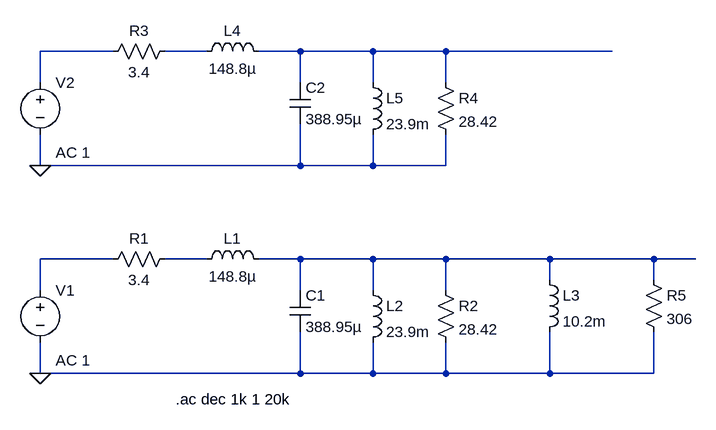
[diagram p0: schematic basic_pyle.asc]
basic_pyle.asc, the LTspice schematic file:
Version 4
SHEET 1 2020 680
WIRE 176 -384 64 -384
WIRE 320 -384 256 -384
WIRE 464 -384 400 -384
WIRE 576 -384 464 -384
WIRE 688 -384 576 -384
WIRE 944 -384 688 -384
WIRE 64 -336 64 -384
WIRE 464 -336 464 -384
WIRE 576 -336 576 -384
WIRE 688 -336 688 -384
WIRE 64 -208 64 -256
WIRE 464 -208 464 -272
WIRE 464 -208 64 -208
WIRE 576 -208 576 -256
WIRE 576 -208 464 -208
WIRE 688 -208 688 -256
WIRE 688 -208 576 -208
WIRE 176 -64 64 -64
WIRE 320 -64 256 -64
WIRE 464 -64 400 -64
WIRE 576 -64 464 -64
WIRE 688 -64 576 -64
WIRE 848 -64 688 -64
WIRE 1008 -64 848 -64
WIRE 1072 -64 1008 -64
WIRE 848 -32 848 -64
WIRE 1008 -32 1008 -64
WIRE 64 -16 64 -64
WIRE 464 -16 464 -64
WIRE 576 -16 576 -64
WIRE 688 -16 688 -64
WIRE 64 112 64 64
WIRE 464 112 464 48
WIRE 464 112 64 112
WIRE 576 112 576 64
WIRE 576 112 464 112
WIRE 688 112 688 64
WIRE 688 112 576 112
WIRE 848 112 848 48
WIRE 848 112 688 112
WIRE 1008 112 1008 48
WIRE 1008 112 848 112
FLAG 64 112 0
FLAG 64 -208 0
SYMBOL voltage 64 -32 R0
WINDOW 123 24 124 Left 2
WINDOW 39 0 0 Left 0
SYMATTR Value2 AC 1
SYMATTR InstName V1
SYMATTR Value ""
SYMBOL res 272 -80 R90
WINDOW 0 0 56 VBottom 2
WINDOW 3 32 56 VTop 2
SYMATTR InstName R1
SYMATTR Value 3.4
SYMBOL ind 304 -48 R270
WINDOW 0 32 56 VTop 2
WINDOW 3 5 56 VBottom 2
SYMATTR InstName L1
SYMATTR Value 148.8µ
SYMBOL cap 448 -16 R0
SYMATTR InstName C1
SYMATTR Value 388.95µ
SYMBOL ind 560 -32 R0
SYMATTR InstName L2
SYMATTR Value 23.9m
SYMBOL res 672 -32 R0
SYMATTR InstName R2
SYMATTR Value 28.42
SYMBOL ind 832 -48 R0
SYMATTR InstName L3
SYMATTR Value 10.2m
SYMBOL voltage 64 -352 R0
WINDOW 123 24 124 Left 2
WINDOW 39 0 0 Left 0
SYMATTR Value2 AC 1
SYMATTR InstName V2
SYMATTR Value ""
SYMBOL res 272 -400 R90
WINDOW 0 0 56 VBottom 2
WINDOW 3 32 56 VTop 2
SYMATTR InstName R3
SYMATTR Value 3.4
SYMBOL ind 304 -368 R270
WINDOW 0 32 56 VTop 2
WINDOW 3 5 56 VBottom 2
SYMATTR InstName L4
SYMATTR Value 148.8µ
SYMBOL cap 448 -336 R0
SYMATTR InstName C2
SYMATTR Value 388.95µ
SYMBOL ind 560 -352 R0
SYMATTR InstName L5
SYMATTR Value 23.9m
SYMBOL res 672 -352 R0
SYMATTR InstName R4
SYMATTR Value 28.42
SYMBOL res 992 -48 R0
SYMATTR InstName R5
SYMATTR Value 306
TEXT 272 152 Left 2 !.ac dec 1k 1 20k

The netlist it stands for:
* basic_pyle.asc
V1 N004 0 AC 1
R1 N005 N004 3.4
L1 N005 N006 148.8µ
C1 N006 0 388.95µ
L2 N006 0 23.9m
R2 N006 0 28.42
L3 N006 0 10.2m
V2 N001 0 AC 1
R3 N002 N001 3.4
L4 N002 N003 148.8µ
C2 N003 0 388.95µ
L5 N003 0 23.9m
R4 N003 0 28.42
R5 N006 0 306
.ac dec 1k 1 20k
.backanno
.end